# Altium schematic sheet MainPower.SchDoc
size A4; SheetNumber: 7; SheetTotal: 16
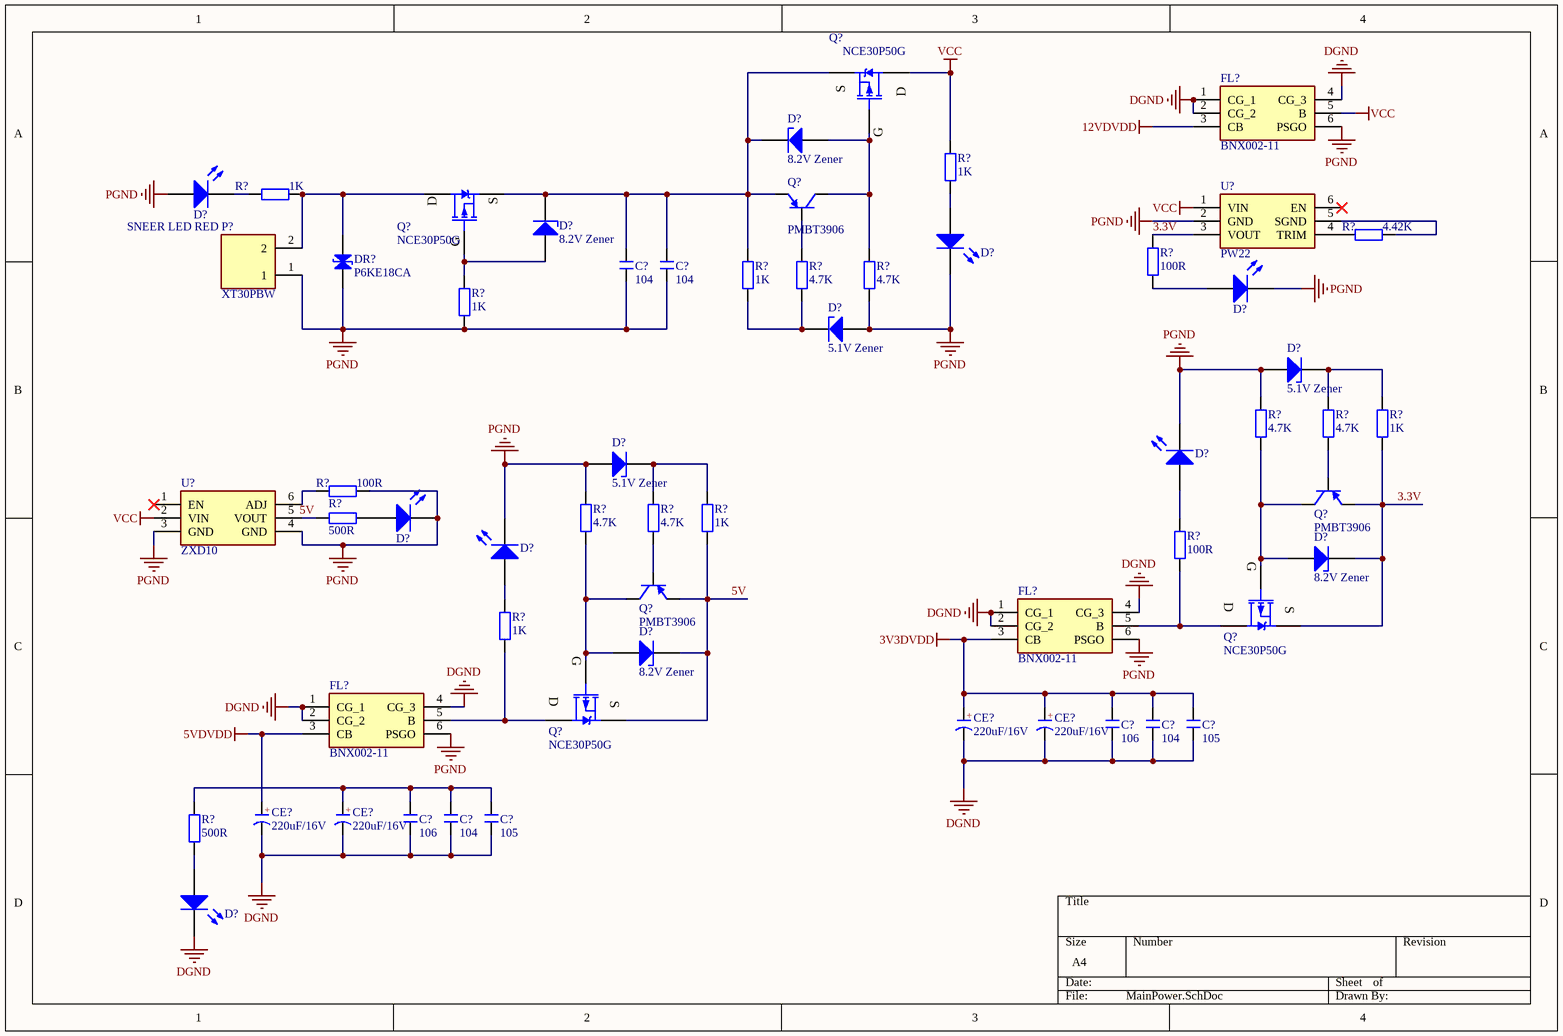
[diagram p0: MainPower.SchDoc]

## Parts
(Parts that share a designator on the sheet are numbered #1, #2 ... from top to bottom, then left to right.)
C?#1  104  [C 0603_L]
C?#2  104  [C 0603_L]
C?#3  106  [C 0603_L]
C?#4  104  [C 0603_L]
C?#5  105  [C 0603_L]
C?#6  106  [C 0603_L]
C?#7  104  [C 0603_L]
C?#8  105  [C 0603_L]
CE?#1  220uF/16V  [CAP 1.5*4*8]
CE?#2  220uF/16V  [CAP 1.5*4*8]
CE?#3  220uF/16V  [CAP 1.5*4*8]
CE?#4  220uF/16V  [CAP 1.5*4*8]
D?#1  8.2V Zener  [DIODE-1206]
D?#2  LED  [LED 0603W]  (value not drawn)
D?#3  8.2V Zener  [DIODE-1206]
D?#4  LED  [LED 0603W]  (value not drawn)
D?#5  LED  [LED 0603W]  (value not drawn)
D?#6  5.1V Zener  [DIODE-1206]
D?#7  5.1V Zener  [DIODE-1206]
D?#8  5.1V Zener  [DIODE-1206]
D?#9  LED  [LED 0603W]  (value not drawn)
D?#10  LED  [LED 0603W]  (value not drawn)
D?#11  LED  [LED 0603W]  (value not drawn)
D?#12  8.2V Zener  [DIODE-1206]
D?#13  8.2V Zener  [DIODE-1206]
D?#14  LED  [LED 0603W]  (value not drawn)
DR?  P6KE18CA  [SMA]
FL?#1  BNX002-11  [BNX00211]
FL?#2  BNX002-11  [BNX00211]
FL?#3  BNX002-11  [BNX00211]
P?  XT30PBW  [XT60]
Q?#1  NCE30P50G  [DFN 5X6]
Q?#2  PMBT3906  [SOT23-3N]
Q?#3  NCE30P50G  [DFN 5X6]
Q?#4  PMBT3906  [SOT23-3N]
Q?#5  NCE30P50G  [DFN 5X6]
Q?#6  PMBT3906  [SOT23-3N]
Q?#7  NCE30P50G  [DFN 5X6]
R?#1  1K  [R 0603_L]
R?#2  1K  [R 0603_L]
R?#3  100R  [R 0603_L]
R?#4  4.42K  [R 0603_L]
R?#5  1K  [R 0603_L]
R?#6  4.7K  [R 0603_L]
R?#7  4.7K  [R 0603_L]
R?#8  1K  [R 0603_L]
R?#9  4.7K  [R 0603_L]
R?#10  4.7K  [R 0603_L]
R?#11  1K  [R 0603_L]
R?#12  100R  [R 0603_L]
R?#13  4.7K  [R 0603_L]
R?#14  500R  [R 0603_L]
R?#15  4.7K  [R 0603_L]
R?#16  1K  [R 0603_L]
R?#17  100R  [R 0603_L]
R?#18  1K  [R 0603_L]
R?#19  500R  [R 0603_L]
U?#1  PW22  [PW22]
U?#2  ZXD10  [ZXD10]

## Nets
3V3DVDD: C?#3.2 C?#4.2 C?#5.2 CE?#1.1(A) CE?#2.1(A) FL?#2.3(CB)
5VDVDD: CE?#3.1(A) FL?#3.3(CB)
12VDVDD: FL?#1.3(CB)
DGND: C?#3.1 C?#4.1 C?#5.1 C?#6.1 C?#7.1 C?#8.1 CE?#1.2(K) CE?#2.2(K) CE?#3.2(K) CE?#4.2(K) D?#14.2(K) FL?#1.1(CG_1) FL?#1.2(CG_2) FL?#1.4(CG_3) FL?#2.1(CG_1) FL?#2.2(CG_2) FL?#2.4(CG_3) FL?#3.1(CG_1) FL?#3.2(CG_2) FL?#3.4(CG_3)
PGND: C?#1.1 C?#2.1 D?#2.1(A) D?#4.2(K) D?#5.2(K) D?#6.1(A) D?#7.1(A) D?#8.1(A) D?#9.2(K) D?#10.2(K) D?#11.2(K) DR?.1(A) FL?#1.6(PSGO) FL?#2.6(PSGO) FL?#3.6(PSGO) P?.1 R?#7.1 R?#8.1 R?#9.1 R?#12.1 R?#13.1 U?#1.2(GND) U?#2.3(GND) U?#2.4(GND)
VCC: FL?#1.5(B) Q?#1.2(D) R?#1.1 U?#1.1(VIN) U?#2.2(VIN)
3.3V: D?#12.2(K) Q?#4.2(E) Q?#5.3(S) R?#3.1 R?#11.1 U?#1.3(VOUT)
5V: D?#13.2(K) Q?#6.2(E) Q?#7.3(S) R?#14.1 R?#16.1 U?#2.5(VOUT)
NetC?#1_2: C?#1.2 C?#2.2 D?#1.2(K) D?#3.2(K) Q?#1.3(S) Q?#2.2(E) Q?#3.3(S) R?#5.1
NetC?#6_2: C?#6.2 C?#7.2 C?#8.2 CE?#4.1(A) R?#19.1
NetD?#1_1: D?#1.1(A) Q?#1.1(G) Q?#2.3(C) R?#7.2
NetD?#2_2: D?#2.2(K) R?#2.2
NetD?#3_1: D?#3.1(A) Q?#3.1(G) R?#8.2
NetD?#4_1: D?#4.1(A) R?#1.2
NetD?#5_1: D?#5.1(A) R?#3.2
NetD?#6_2: D?#6.2(K) R?#5.2 R?#6.2
NetD?#7_2: D?#7.2(K) R?#10.2 R?#11.2
NetD?#8_2: D?#8.2(K) R?#15.2 R?#16.2
NetD?#9_1: D?#9.1(A) R?#17.2
NetD?#10_1: D?#10.1(A) R?#14.2
NetD?#11_1: D?#11.1(A) R?#18.2
NetD?#12_1: D?#12.1(A) Q?#4.3(C) Q?#5.1(G) R?#9.2
NetD?#13_1: D?#13.1(A) Q?#6.3(C) Q?#7.1(G) R?#13.2
NetD?#14_1: D?#14.1(A) R?#19.2
NetDR?_2: DR?.2(K) P?.2 Q?#3.2(D) R?#2.1
NetFL?#2_5: FL?#2.5(B) Q?#5.2(D) R?#17.1
NetFL?#3_5: FL?#3.5(B) Q?#7.2(D) R?#18.1
NetQ?#2_1: Q?#2.1(B) R?#6.1
NetQ?#4_1: Q?#4.1(B) R?#10.1
NetQ?#6_1: Q?#6.1(B) R?#15.1
NetR?#4_1: R?#4.1 U?#1.5(SGND)
NetR?#4_2: R?#4.2 U?#1.4(TRIM)
NetR?#12_2: R?#12.2 U?#2.6(ADJ)

Not connected (* = marked no-connect by the designer): U?#1 6(EN)*; U?#2 1(EN)*

## Notes on the sheet
- (near D?#2) SNEER LED RED
- (in symbol CE) +

## Library data of the parts
C?#1-C?#8 = C: 贴片电容; BOM名称: 无极性贴片电容; 淘宝ID: 封装库来自淘宝 ID：黄晶宝石; 联系售后，技术支持: https://shop463601444.taobao.com; 唯一出售店铺网址: https://shop463601444.taobao.com
CE?#1-CE?#4 = CE: 直插电解电容; 淘宝ID: 封装库来自淘宝 ID：黄晶宝石; BOM名称: 直插电解电容; 联系售后: https://shop463601444.taobao.com
D?#1 D?#3 D?#6-D?#8 D?#12 D?#13 = 稳压二极管: Zener Diode
D?#2 D?#4 D?#5 D?#9-D?#11 D?#14 = LED: 发光二极管
  D?#2 D?#5 D?#9-D?#11 D?#14: 技术支持，联系售后: https://shop463601444.taobao.com
DR? = DR: 瞬态电压抑制二极管; 版权归属: 封装库来自淘宝 ID：黄晶宝石; BOM名称: 瞬态电压抑制二极管; 学习资源: https://shop463601444.taobao.com
FL?#1-FL?#3 = BNX002-11: Filter; Manufacturer_Name: Murata Electronics; Datasheet Link: https://componentsearchengine.com//BNX002-11.pdf; Height: 12.5mm; Mouser2 Part Number: 81-BNX002-11; Mouser2 Price/Stock: https://www.mouser.com/Search/Refine.aspx?Keyword=81-BNX002-11; Manufacturer_Part_Number: BNX002-11
P? = XT60PBW
Q?#1 Q?#3 Q?#5 Q?#7 = IRF4905: P沟场效应管; BOM名称: P沟场效应管
Q?#2 Q?#4 Q?#6 = 8550-SMD: 高频放大-PNP型; 属性: 40V 1.5A 1W 100MHZ
R?#1-R?#19 = R: 贴片电阻